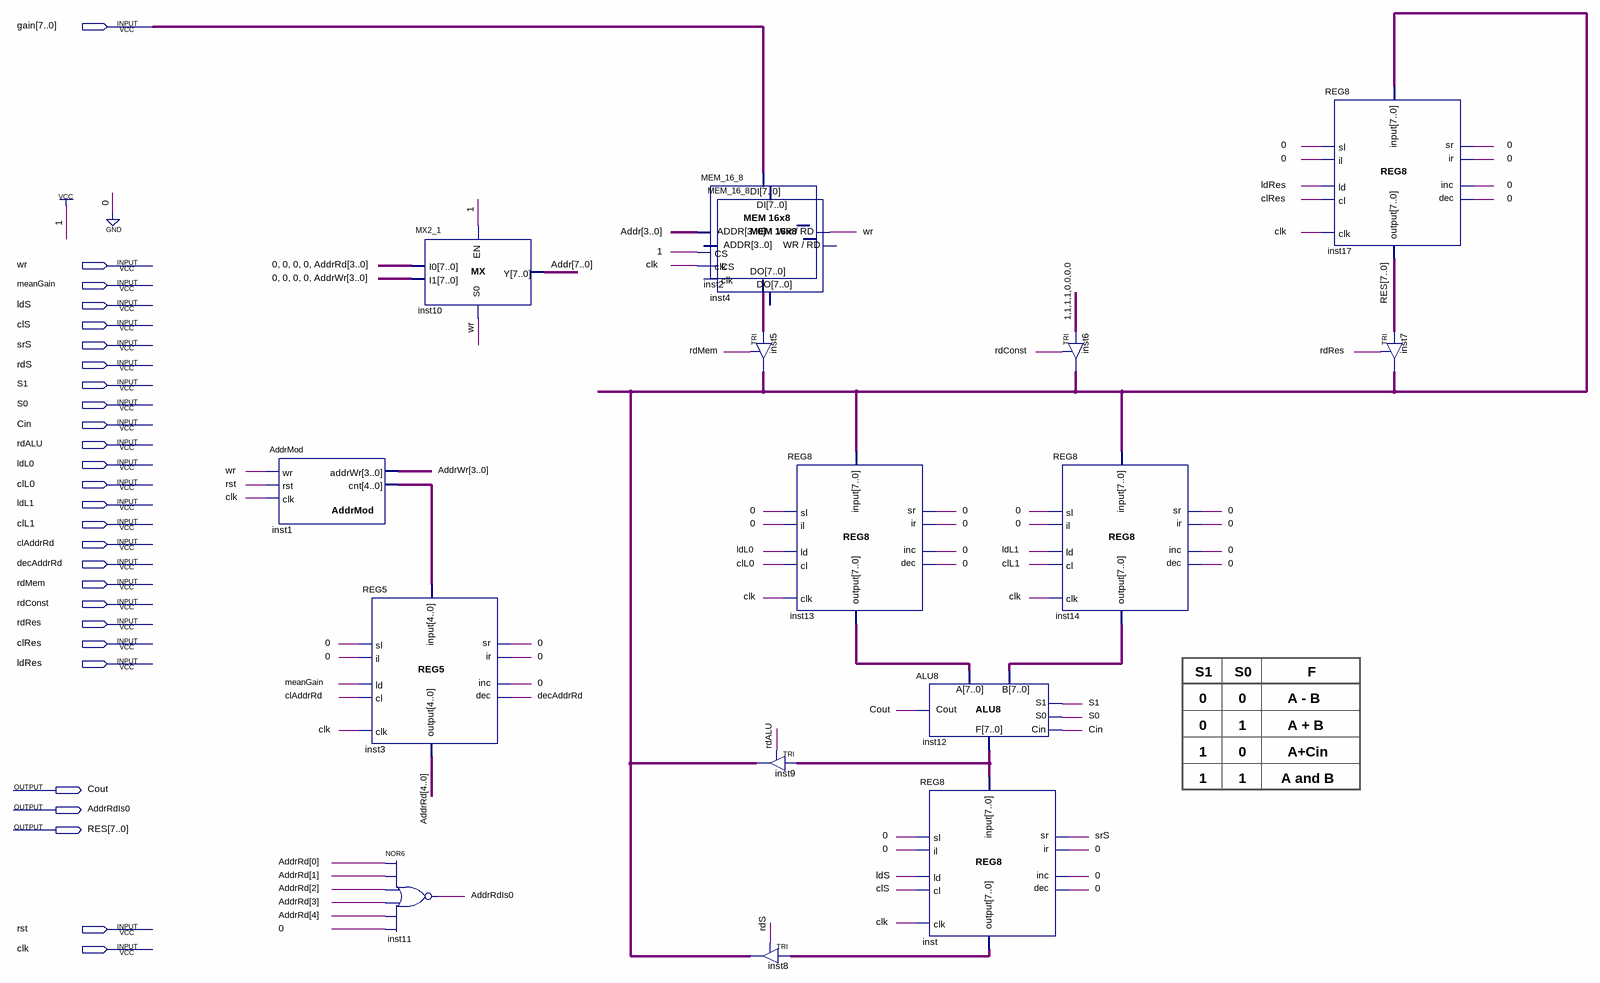
[diagram p0: schematic sheet]
// Quartus schematic MeanGain_operaciona_jedinica.bdf as structural Verilog: 16 symbols, 27 pins
module MeanGain_operaciona_jedinica (
  input  [7:0] gain,
  input  wr,
  input  meanGain,
  input  ldS,
  input  clS,
  input  srS,
  input  rdS,
  input  S1,
  input  S0,
  input  Cin,
  input  rdALU,
  input  ldL0,
  input  clL0,
  input  ldL1,
  input  clL1,
  input  clAddrRd,
  input  decAddrRd,
  input  rdMem,
  input  rdConst,
  input  rdRes,
  input  clRes,
  input  ldRes,
  input  rst,
  input  clk,
  output Cout,
  output AddrRdIs0,
  output [7:0] RES
);

  wire [3:0] AddrWr;
  wire [4:0] AddrRd, inst1_cnt;
  wire [7:0] Addr, inst2_q, inst5_out, inst12_f, inst13_output, inst14_output, inst_output;

  AddrMod inst1 (.wr(wr), .rst(rst), .clk(clk), .addrWr(AddrWr), .cnt(inst1_cnt));
  REG5 inst3 (
    .clk(clk), .ld(meanGain), .\input (inst1_cnt), .sr(1'b0), .ir(1'b0), .sl(1'b0), .il(1'b0), .inc(1'b0),
    .dec(decAddrRd), .cl(clAddrRd), .\output (AddrRd));
  nor inst11 (AddrRdIs0, AddrRd[0], AddrRd[1], AddrRd[2], AddrRd[3], AddrRd[4], 1'b0);
  MX2_1 inst10 (.I1({4'b0000, AddrWr}), .I0({4'b0000, AddrRd[3:0]}), .S0(wr), .EN(1'b1), .Y(Addr));
  MEM_16_8 inst2 (.clk(clk), .data(gain), .wr(wr), .addr(Addr[3:0]), .cs(1'b1), .q(inst2_q));
  MEM_16_8 inst4 ();  // open: clk, data, wr, addr, cs, q
  TRI inst5[7:0] (.IN(inst2_q), .OE(rdMem), .OUT(inst5_out));
  TRI inst9[7:0] (.IN(inst12_f), .OE(rdALU), .OUT(inst5_out));
  TRI inst8[7:0] (.IN(inst_output), .OE(rdS), .OUT(inst5_out));
  REG8 inst13 (
    .clk(clk), .ld(ldL0), .\input (inst5_out), .sr(1'b0), .ir(1'b0), .sl(1'b0), .il(1'b0), .inc(1'b0),
    .dec(1'b0), .cl(clL0), .\output (inst13_output));
  ALU8 inst12 (.Cin(Cin), .S0(S0), .S1(S1), .A(inst13_output), .B(inst14_output), .Cout(Cout), .F(inst12_f));
  REG8 inst (
    .clk(clk), .ld(ldS), .\input (inst12_f), .sr(srS), .ir(1'b0), .sl(1'b0), .il(1'b0), .inc(1'b0),
    .dec(1'b0), .cl(clS), .\output (inst_output));
  TRI inst6[7:0] (.IN(8'b11110000), .OE(rdConst), .OUT(inst5_out));
  REG8 inst14 (
    .clk(clk), .ld(ldL1), .\input (inst5_out), .sr(1'b0), .ir(1'b0), .sl(1'b0), .il(1'b0), .inc(1'b0),
    .dec(1'b0), .cl(clL1), .\output (inst14_output));
  REG8 inst17 (
    .clk(clk), .ld(ldRes), .\input (inst5_out), .sr(1'b0), .ir(1'b0), .sl(1'b0), .il(1'b0), .inc(1'b0),
    .dec(1'b0), .cl(clRes), .\output (RES));
  TRI inst7[7:0] (.IN(RES), .OE(rdRes), .OUT(inst5_out));

  // Notes on the sheet:
  //   S1
  //   S0
  //   F
  //    0
  //    0
  //   A - B
  //    0
  //    1
  //   A + B
  //    1
  //    0
  //   A+Cin
  //    1
  //    1
  //   A and B
endmodule
